# EasyEDA Pro project F407.eprj

# Schematic Schematic1
Board Name: Board1; Create Date: 2025-04-14; Page Name: P1; Project Name: F407; Schematic Name: Schematic1; Update Date: 2025-04-14; Company: 嘉立创EDA; Page Size: A4; Version: V1.0
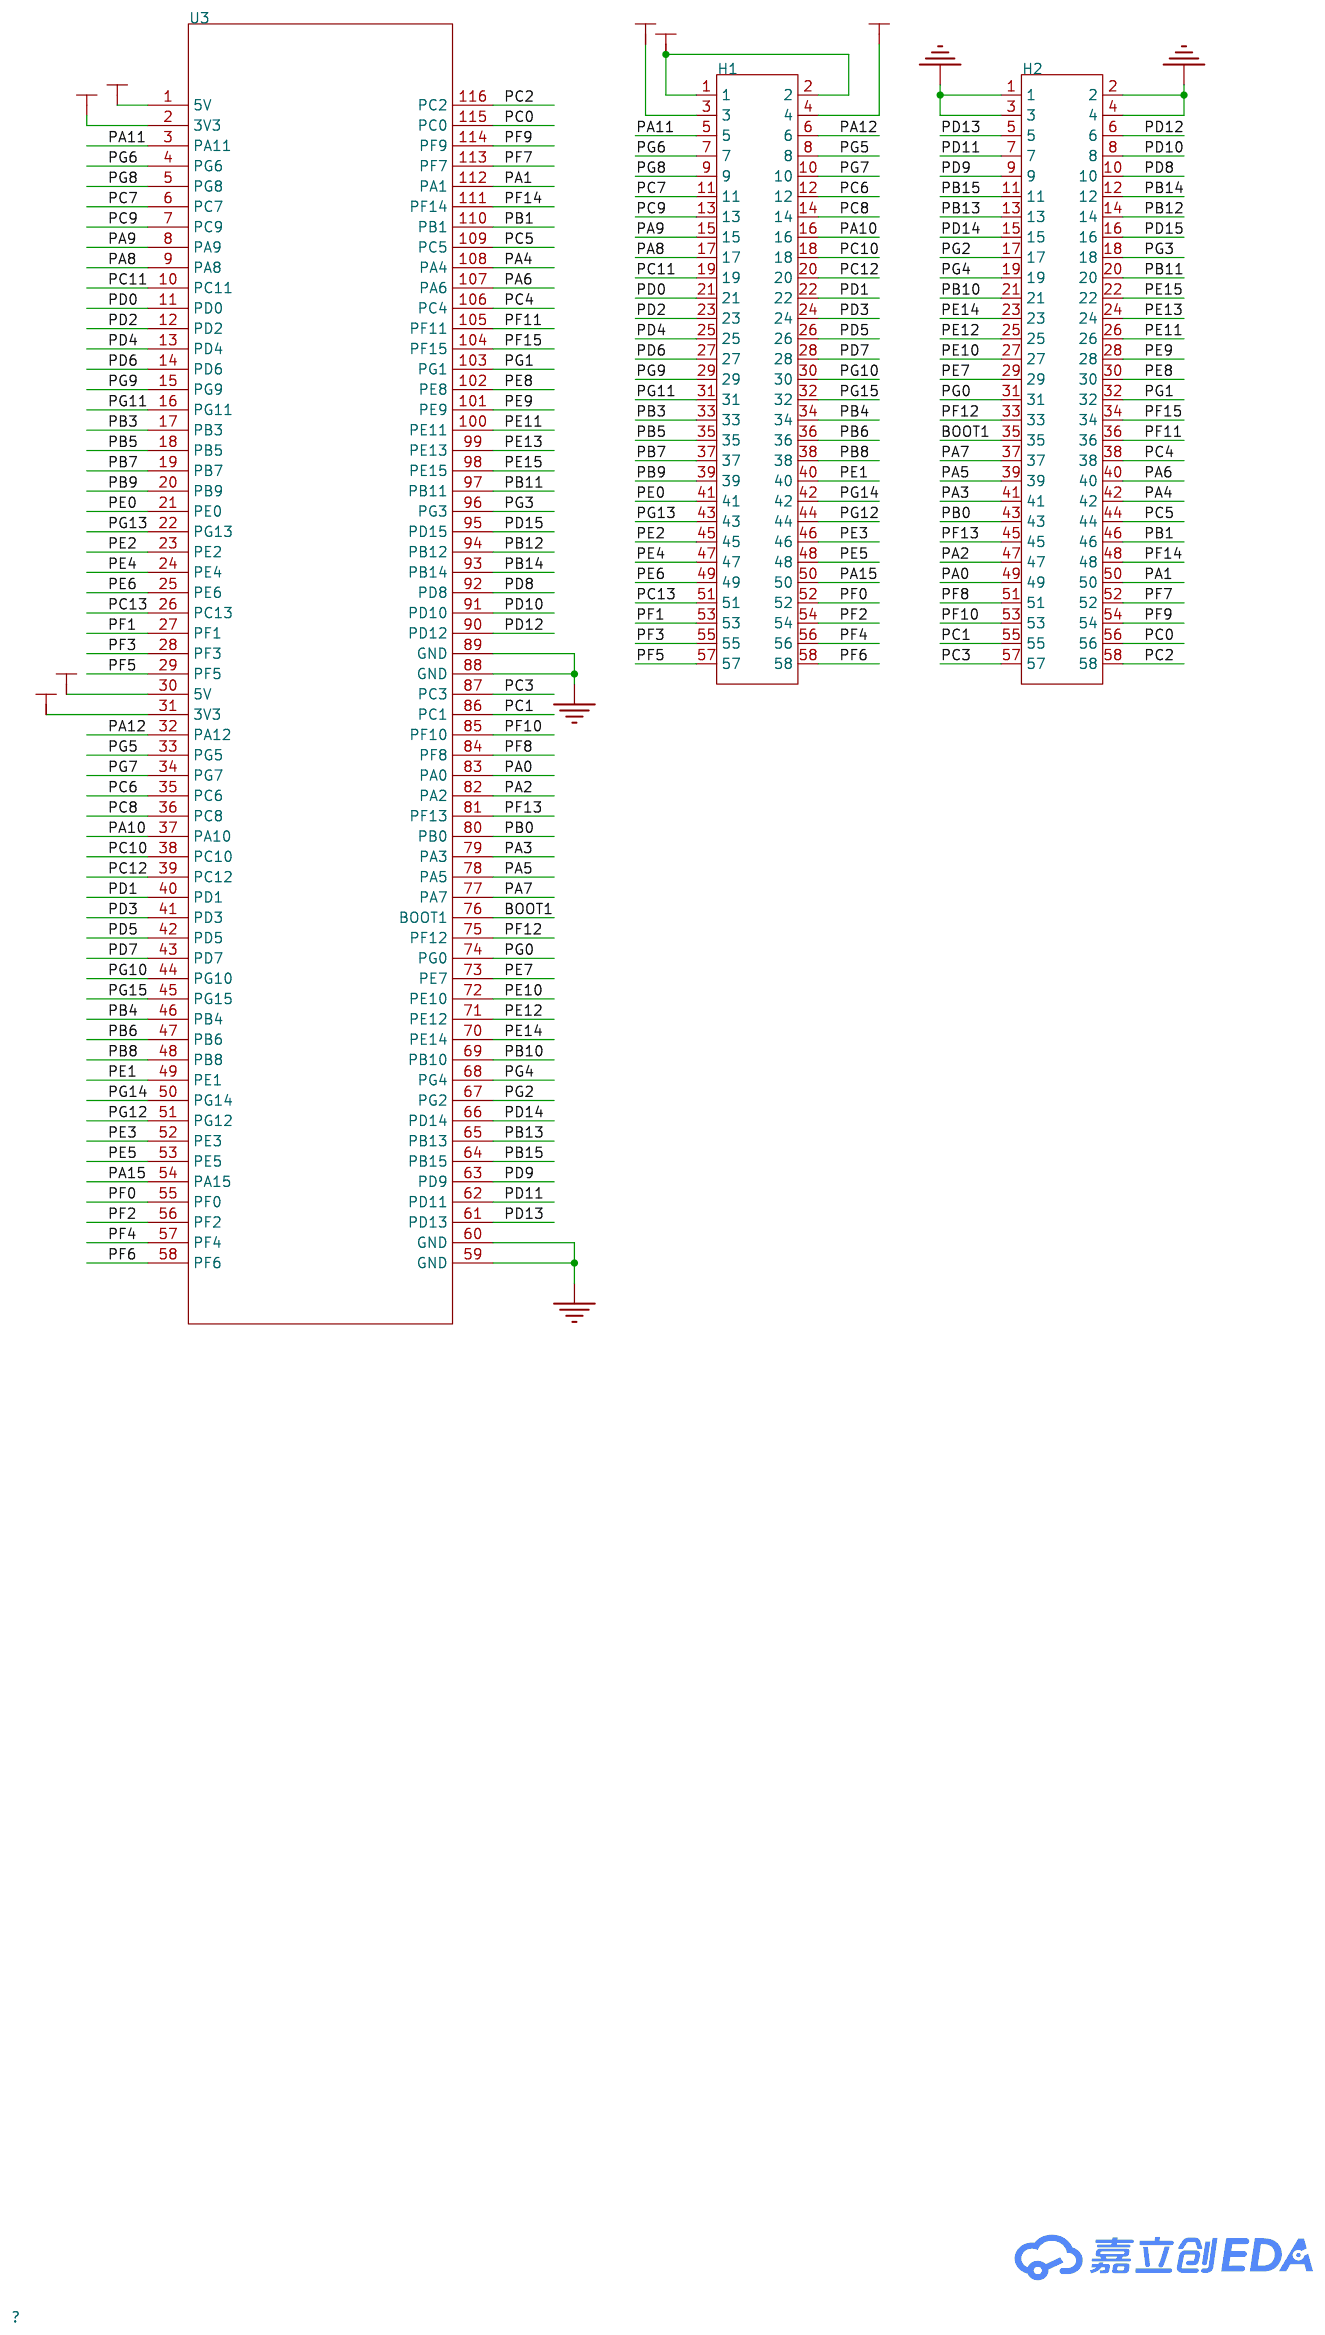
[diagram p0: schematic sheet]

## Parts
H1  X6521WV-2x29H-C60D30  [HDR-TH_58P-P2.54-V-M-R2-C29-S2.54]
H2  X6521WV-2x29H-C60D30  [HDR-TH_58P-P2.54-V-M-R2-C29-S2.54]
U3  -  [F407ZGT6]

## Library data of the parts
H1 H2 = X6521WV-2x29H-C60D30: 插针结构:2x29P;间距:2.54mm;行距:2.54mm;圆针/方针:方针;排数:双排;总PIN位数:58P;额定电流:3A;额定电压:250V;配合针长度:-;塑高:2.5mm;端接针长度:-;触头材质:黄铜;触头镀层:金;工作温度:-40℃~+105℃;颜色:黑色;; LCSC Part Name: 2x29P 间距:2.54mm 方针; Supplier Part: C725901; Manufacturer: XKB Connection(中国星坤); Supplier Footprint: 插件,P=2.54mm; JLCPCB Part Class: 扩展库; Supplier: LCSC; Pin Structure: 2x29P; Pitch: 2.54mm; Row Spacing: 2.54mm; Circluar Pins/Square Pins: 方针; Number of Rows: 双排; Number of Pins: 58P; Current Rating: 3A; Voltage Rating (Max): 250V; Insulation Height: 2.5mm; Contact Material: 黄铜; Contact Plating: 金; Operating Temperature: -40℃~+105℃; Color: 黑色
U3 = F407ZGT6

## Nets
3V3: H1.3 H1.4 U3.2(3V3) U3.31(3V3)
5V: H1.1 H1.2 U3.1(5V) U3.30(5V)
GND: H2.1 H2.2 H2.3 H2.4 U3.59(GND) U3.60(GND) U3.88(GND) U3.89(GND)
BOOT1: H2.35 U3.76(BOOT1)
PA0: H2.49 U3.83(PA0)
PA1: H2.50 U3.112(PA1)
PA2: H2.47 U3.82(PA2)
PA3: H2.41 U3.79(PA3)
PA4: H2.42 U3.108(PA4)
PA5: H2.39 U3.78(PA5)
PA6: H2.40 U3.107(PA6)
PA7: H2.37 U3.77(PA7)
PA8: H1.17 U3.9(PA8)
PA9: H1.15 U3.8(PA9)
PA10: H1.16 U3.37(PA10)
PA11: H1.5 U3.3(PA11)
PA12: H1.6 U3.32(PA12)
PA15: H1.50 U3.54(PA15)
PB0: H2.43 U3.80(PB0)
PB1: H2.46 U3.110(PB1)
PB3: H1.33 U3.17(PB3)
PB4: H1.34 U3.46(PB4)
PB5: H1.35 U3.18(PB5)
PB6: H1.36 U3.47(PB6)
PB7: H1.37 U3.19(PB7)
PB8: H1.38 U3.48(PB8)
PB9: H1.39 U3.20(PB9)
PB10: H2.21 U3.69(PB10)
PB11: H2.20 U3.97(PB11)
PB12: H2.14 U3.94(PB12)
PB13: H2.13 U3.65(PB13)
PB14: H2.12 U3.93(PB14)
PB15: H2.11 U3.64(PB15)
PC0: H2.56 U3.115(PC0)
PC1: H2.55 U3.86(PC1)
PC2: H2.58 U3.116(PC2)
PC3: H2.57 U3.87(PC3)
PC4: H2.38 U3.106(PC4)
PC5: H2.44 U3.109(PC5)
PC6: H1.12 U3.35(PC6)
PC7: H1.11 U3.6(PC7)
PC8: H1.14 U3.36(PC8)
PC9: H1.13 U3.7(PC9)
PC10: H1.18 U3.38(PC10)
PC11: H1.19 U3.10(PC11)
PC12: H1.20 U3.39(PC12)
PC13: H1.51 U3.26(PC13)
PD0: H1.21 U3.11(PD0)
PD1: H1.22 U3.40(PD1)
PD2: H1.23 U3.12(PD2)
PD3: H1.24 U3.41(PD3)
PD4: H1.25 U3.13(PD4)
PD5: H1.26 U3.42(PD5)
PD6: H1.27 U3.14(PD6)
PD7: H1.28 U3.43(PD7)
PD8: H2.10 U3.92(PD8)
PD9: H2.9 U3.63(PD9)
PD10: H2.8 U3.91(PD10)
PD11: H2.7 U3.62(PD11)
PD12: H2.6 U3.90(PD12)
PD13: H2.5 U3.61(PD13)
PD14: H2.15 U3.66(PD14)
PD15: H2.16 U3.95(PD15)
PE0: H1.41 U3.21(PE0)
PE1: H1.40 U3.49(PE1)
PE2: H1.45 U3.23(PE2)
PE3: H1.46 U3.52(PE3)
PE4: H1.47 U3.24(PE4)
PE5: H1.48 U3.53(PE5)
PE6: H1.49 U3.25(PE6)
PE7: H2.29 U3.73(PE7)
PE8: H2.30 U3.102(PE8)
PE9: H2.28 U3.101(PE9)
PE10: H2.27 U3.72(PE10)
PE11: H2.26 U3.100(PE11)
PE12: H2.25 U3.71(PE12)
PE13: H2.24 U3.99(PE13)
PE14: H2.23 U3.70(PE14)
PE15: H2.22 U3.98(PE15)
PF0: H1.52 U3.55(PF0)
PF1: H1.53 U3.27(PF1)
PF2: H1.54 U3.56(PF2)
PF3: H1.55 U3.28(PF3)
PF4: H1.56 U3.57(PF4)
PF5: H1.57 U3.29(PF5)
PF6: H1.58 U3.58(PF6)
PF7: H2.52 U3.113(PF7)
PF8: H2.51 U3.84(PF8)
PF9: H2.54 U3.114(PF9)
PF10: H2.53 U3.85(PF10)
PF11: H2.36 U3.105(PF11)
PF12: H2.33 U3.75(PF12)
PF13: H2.45 U3.81(PF13)
PF14: H2.48 U3.111(PF14)
PF15: H2.34 U3.104(PF15)
PG0: H2.31 U3.74(PG0)
PG1: H2.32 U3.103(PG1)
PG2: H2.17 U3.67(PG2)
PG3: H2.18 U3.96(PG3)
PG4: H2.19 U3.68(PG4)
PG5: H1.8 U3.33(PG5)
PG6: H1.7 U3.4(PG6)
PG7: H1.10 U3.34(PG7)
PG8: H1.9 U3.5(PG8)
PG9: H1.29 U3.15(PG9)
PG10: H1.30 U3.44(PG10)
PG11: H1.31 U3.16(PG11)
PG12: H1.44 U3.51(PG12)
PG13: H1.43 U3.22(PG13)
PG14: H1.42 U3.50(PG14)
PG15: H1.32 U3.45(PG15)

# Board PCB1
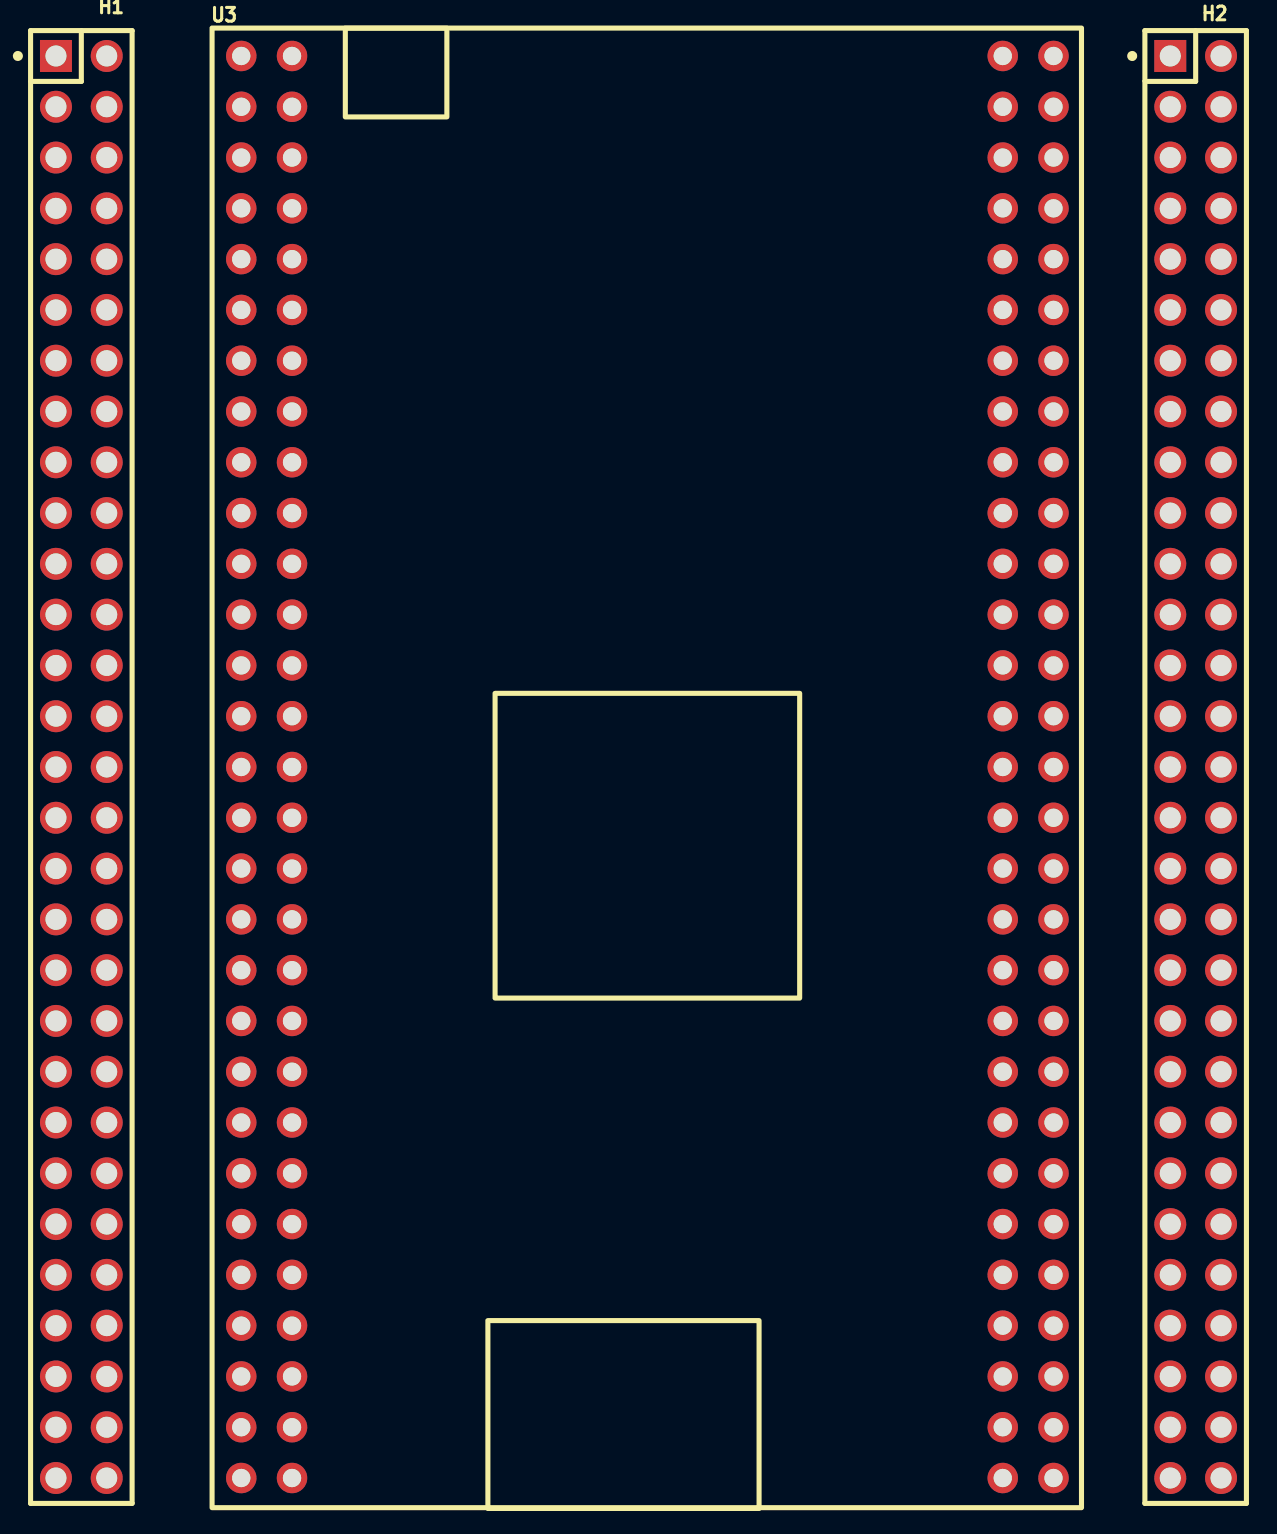
[diagram p1: board, top side]
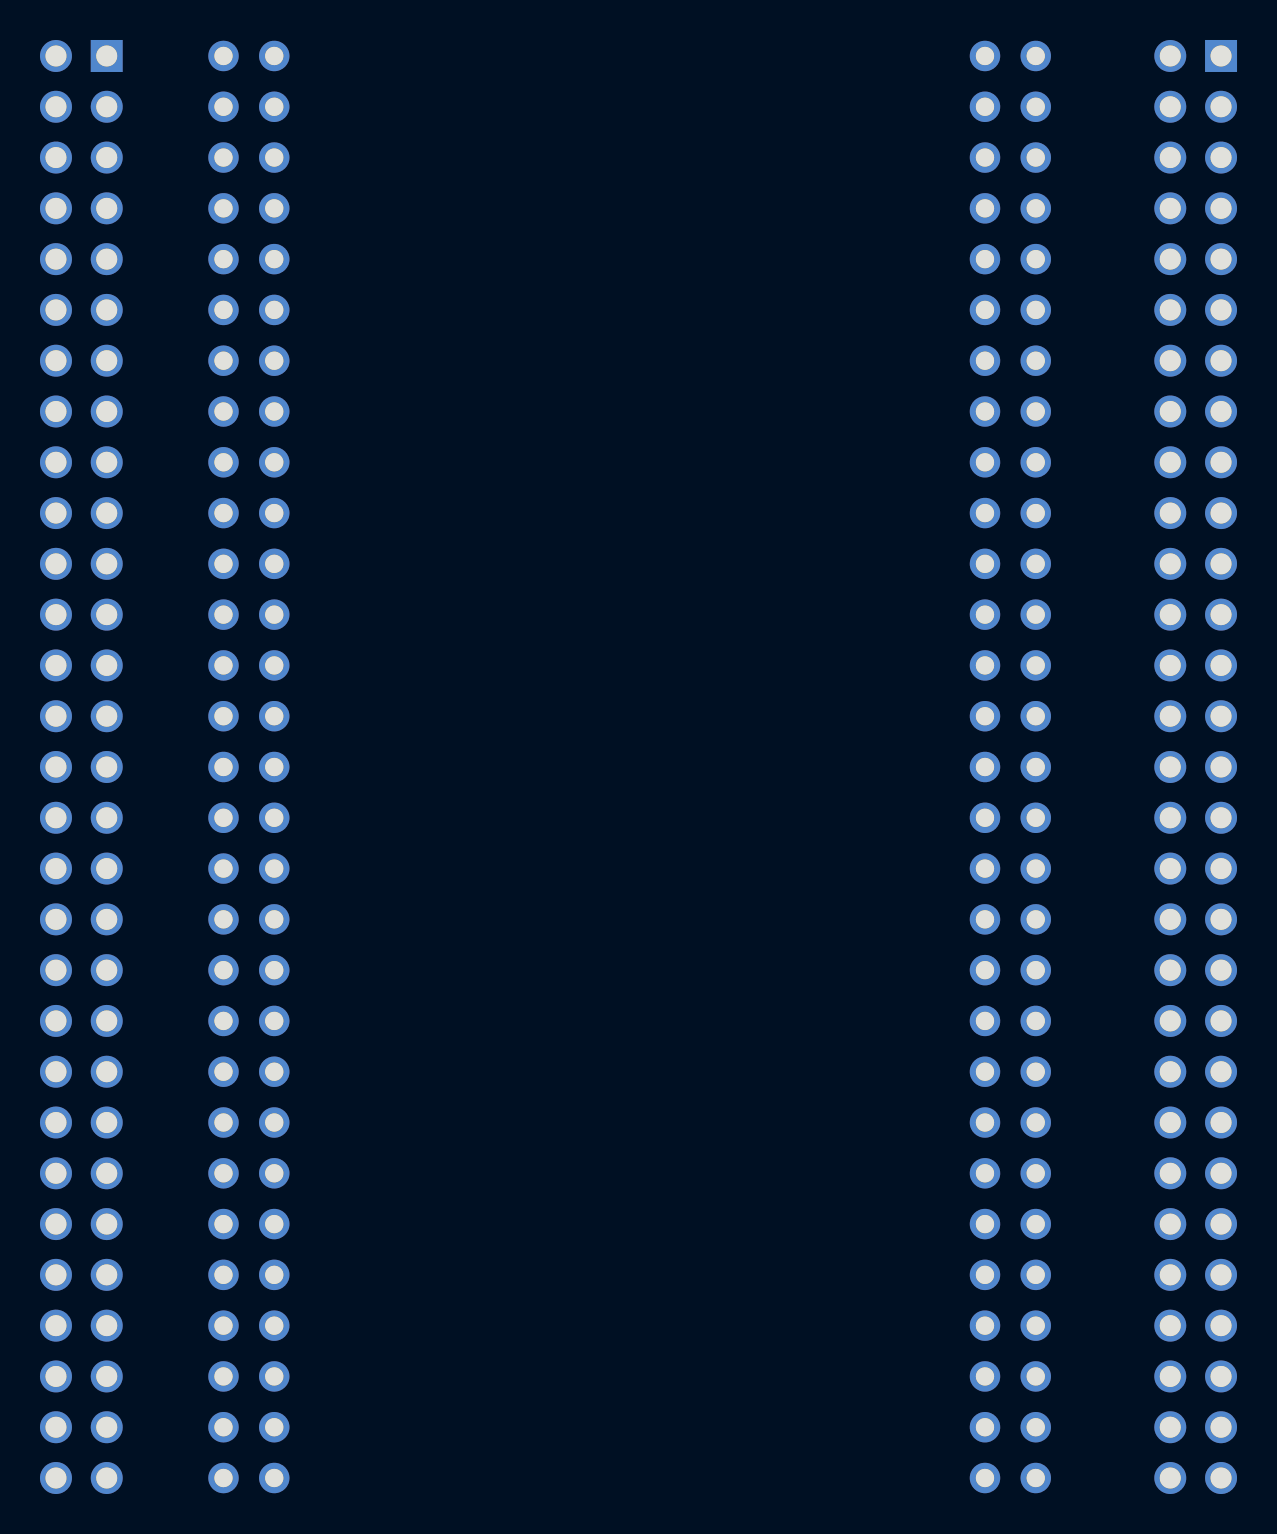
[diagram p2: board, bottom side, seen from below]

No outline. copper layers: Top Layer, Bottom Layer. Coordinates in mm from the lowest, leftmost part position.
Stack: Top Layer 0.035mm / Dielectric1 1.51mm FR4 er 4.5 / Bottom Layer 0.035mm

## Design rules (mm)
template: JLCPCB Capability(Two Layers Board)
spacing copperThickness1oz (default): track to track 0.102, other pairs 0.152 to 0.3
spacing copperThickness2oz: track to track 0.203, other pairs 0.152 to 0.3
track width copperThickness1oz (default): min 0.127, default 0.254, max 2.54
track width copperThickness2oz: min 0.203, default 0.254, max 2.54
differential pair differentialPair (default): width min 0.127, default 0.254, max 2.54; gap min 0.152, default 0.152
via viaSize (default): diameter min 0.5, default 0.61, max 10; hole min 0.3, default 0.305, max 6.3

## Placement (name value [footprint] x y rotation side)
H1  X6521WV-2x29H-C60D30  [HDR-TH_58P-P2.54-V-M-R2-C29-S2.54]  0 0 270 top
H2  X6521WV-2x29H-C60D30  [HDR-TH_58P-P2.54-V-M-R2-C29-S2.54]  55.75 0 270 top
U3  -  [F407ZGT6]  8 35.56 0 top

## Footprints (pads in the part's own frame, mm; a bottom-side part is the same pattern mirrored in y, then rotated)
F407ZGT6
  round 1.524 hole 0.914: 1(0,0) 2(0,-2.54) 3(0,-5.08) 4(0,-7.62) 5(0,-10.16) 6(0,-12.7) 7(0,-15.24) 8(0,-17.78) 9(0,-20.32) 10(0,-22.86) 11(0,-25.4) 12(0,-27.94) 13(0,-30.48) 14(0,-33.02) 15(0,-35.56) 16(0,-38.1) 17(0,-40.64) 18(0,-43.18) 19(0,-45.72) 20(0,-48.26) 21(0,-50.8) 22(0,-53.34) 23(0,-55.88) 24(0,-58.42) 25(0,-60.96) 26(0,-63.5) 27(0,-66.04) 28(0,-68.58) 29(0,-71.12) 30(2.54,0) 31(2.54,-2.54) 32(2.54,-5.08) 33(2.54,-7.62) 34(2.54,-10.16) 35(2.54,-12.7) 36(2.54,-15.24) 37(2.54,-17.78) 38(2.54,-20.32) 39(2.54,-22.86) 40(2.54,-25.4) 41(2.54,-27.94) 42(2.54,-30.48) 43(2.54,-33.02) 44(2.54,-35.56) 45(2.54,-38.1) 46(2.54,-40.64) 47(2.54,-43.18) 48(2.54,-45.72) 49(2.54,-48.26) 50(2.54,-50.8) 51(2.54,-53.34) 52(2.54,-55.88) 53(2.54,-58.42) 54(2.54,-60.96) 55(2.54,-63.5) 56(2.54,-66.04) 57(2.54,-68.58) 58(2.54,-71.12) 59(38.1,0) 60(38.1,-2.54) 61(38.1,-5.08) 62(38.1,-7.62) 63(38.1,-10.16) 64(38.1,-12.7) 65(38.1,-15.24) 66(38.1,-17.78) 67(38.1,-20.32) 68(38.1,-22.86) 69(38.1,-25.4) 70(38.1,-27.94) 71(38.1,-30.48) 72(38.1,-33.02) 73(38.1,-35.56) 74(38.1,-38.1) 75(38.1,-40.64) 76(38.1,-43.18) 77(38.1,-45.72) 78(38.1,-48.26) 79(38.1,-50.8) 80(38.1,-53.34) 81(38.1,-55.88) 82(38.1,-58.42) 83(38.1,-60.96) 84(38.1,-63.5) 85(38.1,-66.04) 86(38.1,-68.58) 87(38.1,-71.12) 88(40.64,0) 89(40.64,-2.54) 90(40.64,-5.08) 91(40.64,-7.62) 92(40.64,-10.16) 93(40.64,-12.7) 94(40.64,-15.24) 95(40.64,-17.78) 96(40.64,-20.32) 97(40.64,-22.86) 98(40.64,-25.4) 99(40.64,-27.94) 100(40.64,-30.48) 101(40.64,-33.02) 102(40.64,-35.56) 103(40.64,-38.1) 104(40.64,-40.64) 105(40.64,-43.18) 106(40.64,-45.72) 107(40.64,-48.26) 108(40.64,-50.8) 109(40.64,-53.34) 110(40.64,-55.88) 111(40.64,-58.42) 112(40.64,-60.96) 113(40.64,-63.5) 114(40.64,-66.04) 115(40.64,-68.58) 116(40.64,-71.12)
HDR-TH_58P-P2.54-V-M-R2-C29-S2.54
  rect 1.6x1.6 hole 1.05: 1(-35.56,-1.27)
  round 1.6 hole 1.05: 2(-35.56,1.27) 3(-33.02,-1.27) 4(-33.02,1.27) 5(-30.48,-1.27) 6(-30.48,1.27) 7(-27.94,-1.27) 8(-27.94,1.27) 9(-25.4,-1.27) 10(-25.4,1.27) 11(-22.86,-1.27) 12(-22.86,1.27) 13(-20.32,-1.27) 14(-20.32,1.27) 15(-17.78,-1.27) 16(-17.78,1.27) 17(-15.24,-1.27) 18(-15.24,1.27) 19(-12.7,-1.27) 20(-12.7,1.27) 21(-10.16,-1.27) 22(-10.16,1.27) 23(-7.62,-1.27) 24(-7.62,1.27) 25(-5.08,-1.27) 26(-5.08,1.27) 27(-2.54,-1.27) 28(-2.54,1.27) 29(0,-1.27) 30(0,1.27) 31(2.54,-1.27) 32(2.54,1.27) 33(5.08,-1.27) 34(5.08,1.27) 35(7.62,-1.27) 36(7.62,1.27) 37(10.16,-1.27) 38(10.16,1.27) 39(12.7,-1.27) 40(12.7,1.27) 41(15.24,-1.27) 42(15.24,1.27) 43(17.78,-1.27) 44(17.78,1.27) 45(20.32,-1.27) 46(20.32,1.27) 47(22.86,-1.27) 48(22.86,1.27) 49(25.4,-1.27) 50(25.4,1.27) 51(27.94,-1.27) 52(27.94,1.27) 53(30.48,-1.27) 54(30.48,1.27) 55(33.02,-1.27) 56(33.02,1.27) 57(35.56,-1.27) 58(35.56,1.27)

## Nets
As in the schematic.
